# EAGLE design rpihat (EAGLE 7.3.0)
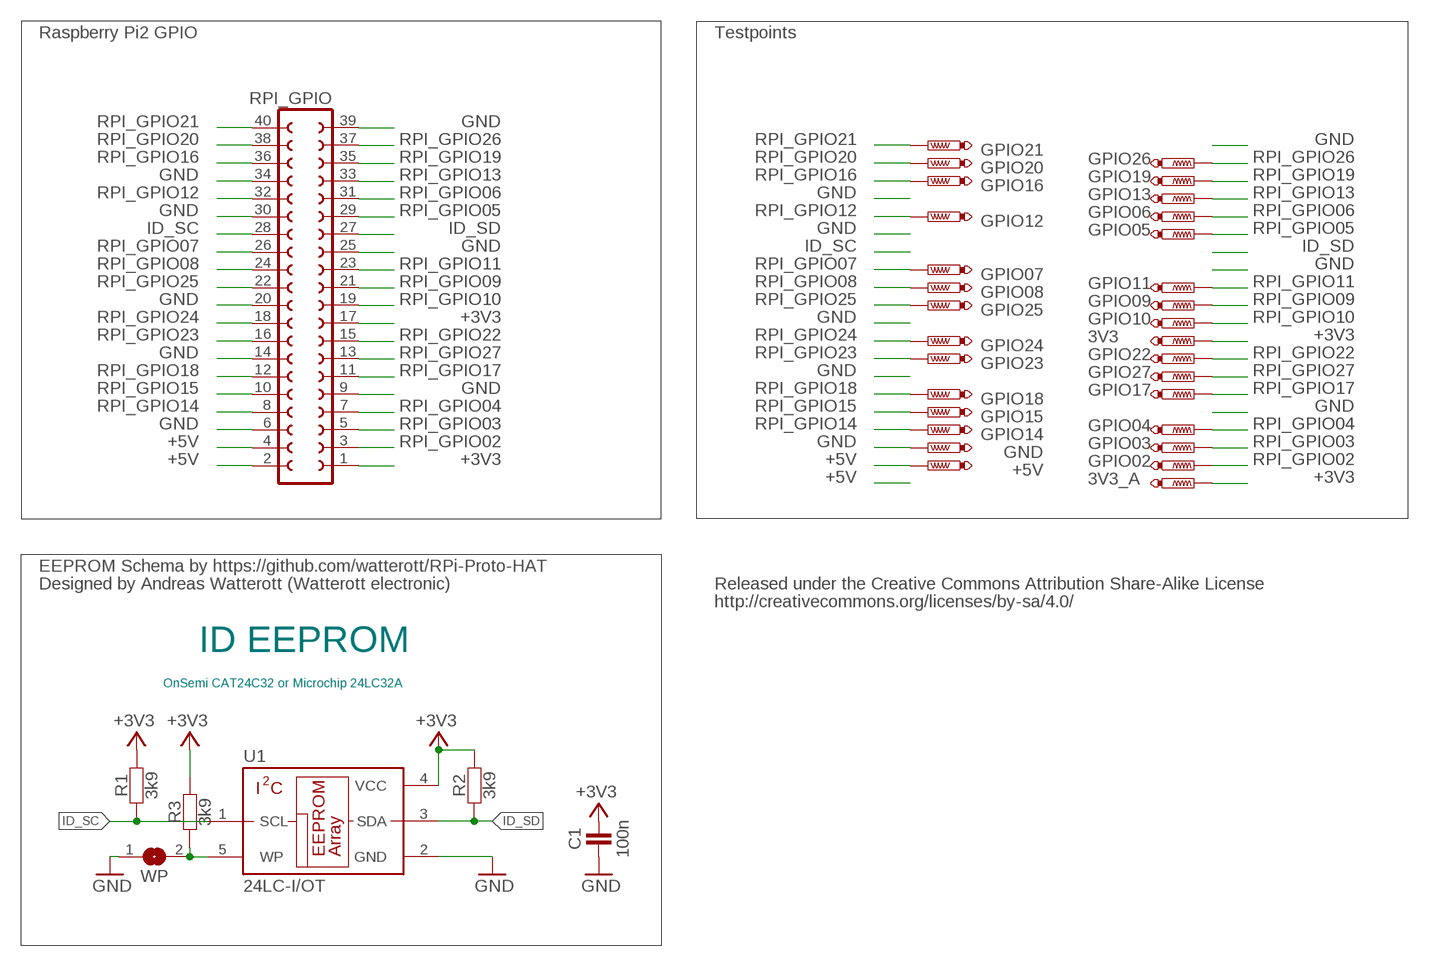
[diagram p0: schematic, sheet 1]

## Parts
3V3  +3.3V  PTR1TP06R  [TP06R]
3V3_A  +3.3V  PTR1TP06R  [TP06R]
+5V  PTR1TP06R  [TP06R]
C1  100n  CAPACITOR-C0603  [R0603]
GND  PTR1TP06R  [TP06R]
GPIO02  PTR1TP06R  [TP06R]
GPIO03  PTR1TP06R  [TP06R]
GPIO04  PTR1TP06R  [TP06R]
GPIO05  PTR1TP06R  [TP06R]
GPIO06  PTR1TP06R  [TP06R]
GPIO07  PTR1TP06R  [TP06R]
GPIO08  PTR1TP06R  [TP06R]
GPIO09  PTR1TP06R  [TP06R]
GPIO10  PTR1TP06R  [TP06R]
GPIO11  PTR1TP06R  [TP06R]
GPIO12  PTR1TP06R  [TP06R]
GPIO13  PTR1TP06R  [TP06R]
GPIO14  PTR1TP06R  [TP06R]
GPIO15  PTR1TP06R  [TP06R]
GPIO16  PTR1TP06R  [TP06R]
GPIO17  PTR1TP06R  [TP06R]
GPIO18  PTR1TP06R  [TP06R]
GPIO19  PTR1TP06R  [TP06R]
GPIO20  PTR1TP06R  [TP06R]
GPIO21  PTR1TP06R  [TP06R]
GPIO22  PTR1TP06R  [TP06R]
GPIO23  PTR1TP06R  [TP06R]
GPIO24  PTR1TP06R  [TP06R]
GPIO25  PTR1TP06R  [TP06R]
GPIO26  PTR1TP06R  [TP06R]
GPIO27  PTR1TP06R  [TP06R]
R1  3k9  RESISTOR-R0603  [R0603]
R2  3k9  RESISTOR-R0603  [R0603]
R3  3k9  RESISTOR-R0603  [R0603]
RPI_GPIO  FE20-2  [FE20-2]
U1  24LC-I/OT  [SOT23-5]
WP  JUMPER2-NOCREAM  [JUMPER2_NC]

## Nets
+3V3: 3V3.TP 3V3_A.TP C1.2 R1.2 R2.2 R3.2 RPI_GPIO.1 RPI_GPIO.17 U1.4(VCC)
+5V: +5V.TP RPI_GPIO.2 RPI_GPIO.4
GND: C1.1 GND.TP RPI_GPIO.6 RPI_GPIO.9 RPI_GPIO.14 RPI_GPIO.20 RPI_GPIO.25 RPI_GPIO.30 RPI_GPIO.34 RPI_GPIO.39 U1.2(GND) WP.1
ID_SC: R1.1 RPI_GPIO.28 U1.1(SCL)
ID_SD: R2.1 RPI_GPIO.27 U1.3(SDA)
RPI_GPIO02: GPIO02.TP RPI_GPIO.3
RPI_GPIO03: GPIO03.TP RPI_GPIO.5
RPI_GPIO04: GPIO04.TP RPI_GPIO.7
RPI_GPIO05: GPIO05.TP RPI_GPIO.29
RPI_GPIO06: GPIO06.TP RPI_GPIO.31
RPI_GPIO07: GPIO07.TP RPI_GPIO.26
RPI_GPIO08: GPIO08.TP RPI_GPIO.24
RPI_GPIO09: GPIO09.TP RPI_GPIO.21
RPI_GPIO10: GPIO10.TP RPI_GPIO.19
RPI_GPIO11: GPIO11.TP RPI_GPIO.23
RPI_GPIO12: GPIO12.TP RPI_GPIO.32
RPI_GPIO13: GPIO13.TP RPI_GPIO.33
RPI_GPIO14: GPIO14.TP RPI_GPIO.8
RPI_GPIO15: GPIO15.TP RPI_GPIO.10
RPI_GPIO16: GPIO16.TP RPI_GPIO.36
RPI_GPIO17: GPIO17.TP RPI_GPIO.11
RPI_GPIO18: GPIO18.TP RPI_GPIO.12
RPI_GPIO19: GPIO19.TP RPI_GPIO.35
RPI_GPIO20: GPIO20.TP RPI_GPIO.38
RPI_GPIO21: GPIO21.TP RPI_GPIO.40
RPI_GPIO22: GPIO22.TP RPI_GPIO.15
RPI_GPIO23: GPIO23.TP RPI_GPIO.16
RPI_GPIO24: GPIO24.TP RPI_GPIO.18
RPI_GPIO25: GPIO25.TP RPI_GPIO.22
RPI_GPIO26: GPIO26.TP RPI_GPIO.37
RPI_GPIO27: GPIO27.TP RPI_GPIO.13
WP: R3.1 U1.5(WP) WP.2

## Notes on the sheet
- Raspberry Pi2 GPIO | Testpoints
- EEPROM Schema by https://github.com/watterott/RPi-Proto-HAT
- Designed by Andreas Watterott (Watterott electronic) | Released under the Creative Commons Attribution Share-Alike License
- http://creativecommons.org/licenses/by-sa/4.0/
- ID EEPROM
- OnSemi CAT24C32 or Microchip 24LC32A

## Library data of the parts
3V3 3V3_A +5V GND GPIO02-GPIO09 GPIO10-GPIO27 = testpad:PTR1: TEST PIN
C1 = we-rcl:CAPACITOR: Capacitors ...2.2uF -> 0603 ...4.7uF -> 0805 ...10uF -> 1206
R1-R3 = we-rcl:RESISTOR
RPI_GPIO = con-lsta:FE20-2: FEMALE HEADER; OC_FARNELL: unknown; OC_NEWARK: unknown
U1 = we-chip:24LC*: Microchip I2C EEPROM 2 Kbit - 24LC02B - 24LC02BT-I/OTDKR-ND 32 Kbit- 24LC32A - 24LC32AT-I/OTDKR-ND; DIGIKEY: 24LC32AT-I/OTDKR-ND
WP = we-rcl:JUMPER2

## Board
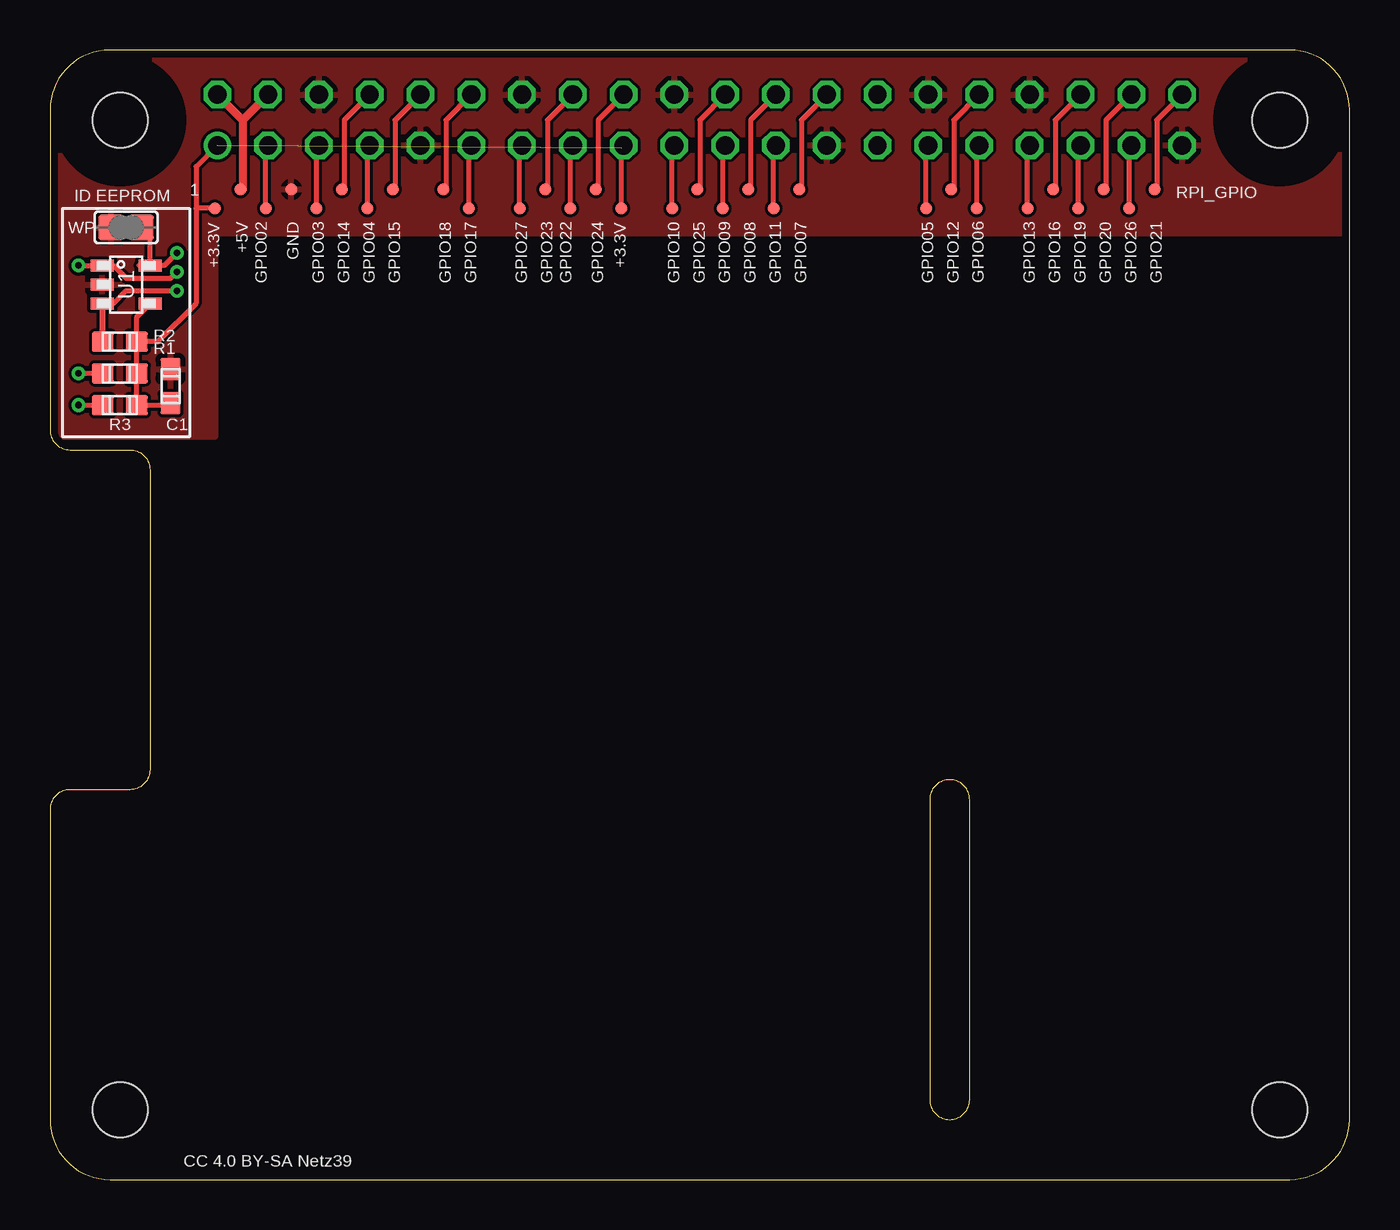
[diagram p1: board, top side]
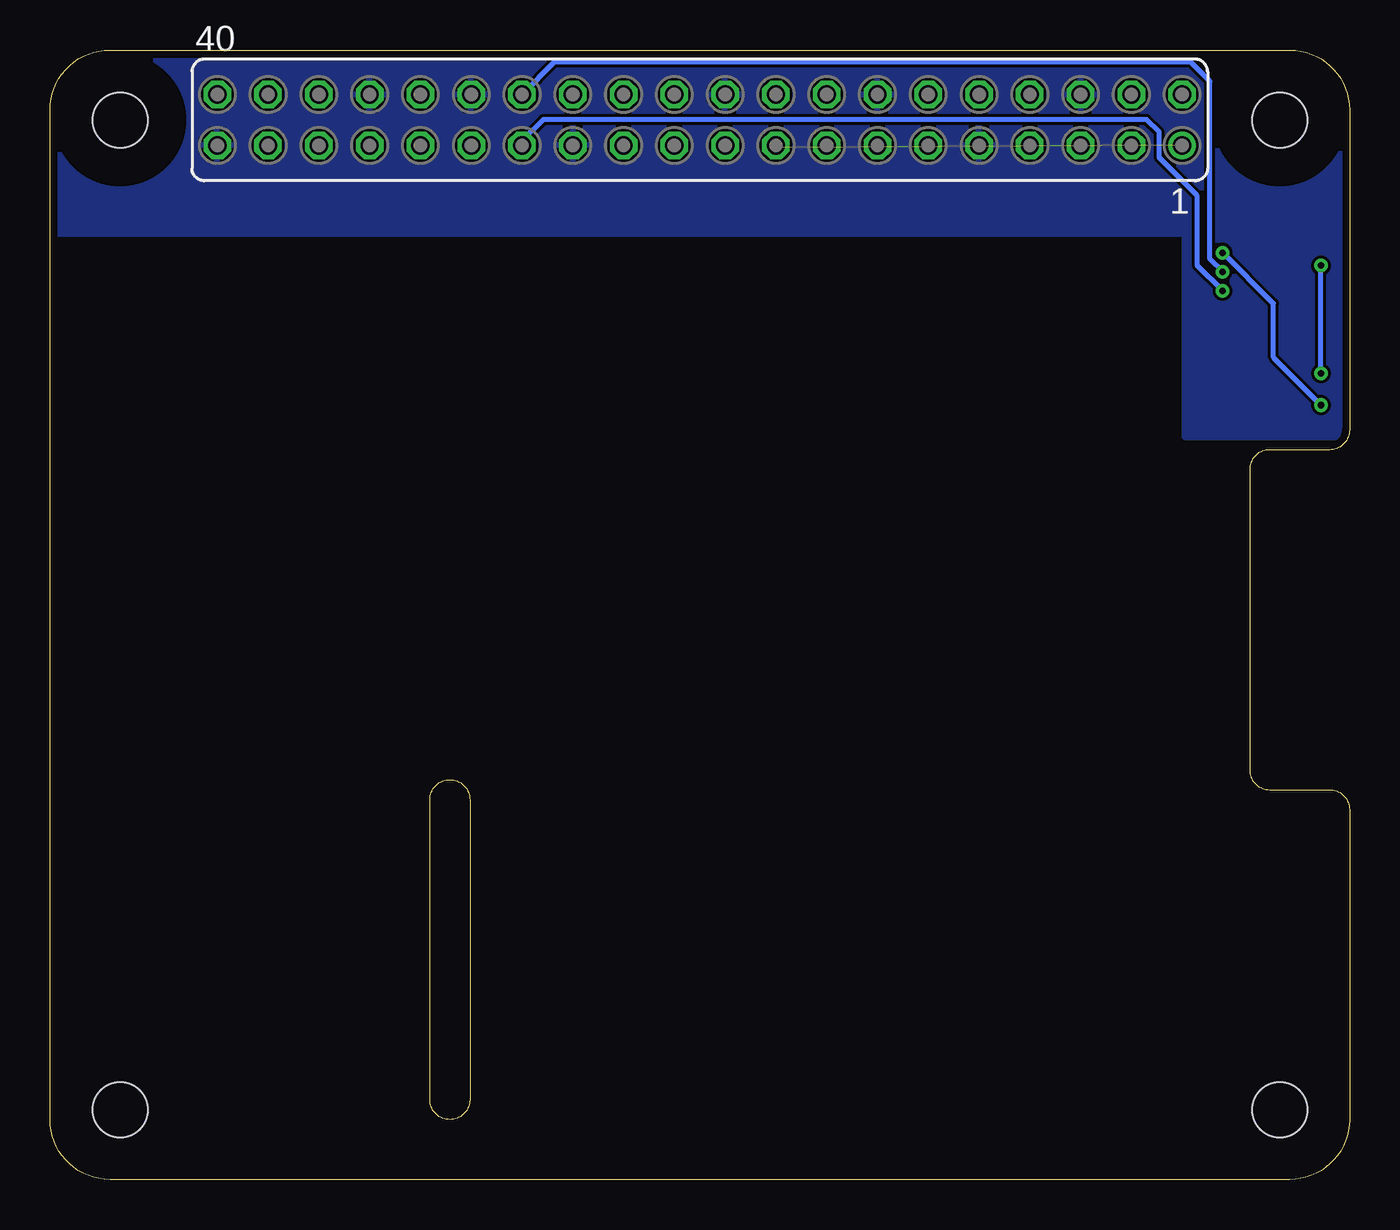
[diagram p2: board, bottom side, seen from below]

Size 65 x 56.5 mm. Coordinates in mm from the lower left corner, seen from the top.
Outline: 0,53.5 0,37.5 arc90 1,36.5 4,36.5 arc-90 5,35.5 5,20.5 arc-90 4,19.5 1,19.5 arc90 0,18.5 0,3 arc90 3,0 62,0 arc90 65,3 65,53.5 arc90 62,56.5 3,56.5 arc90 0,53.5
Outline: 45,20 arc90 44,19 44,4 arc90 45,3 arc90 46,4 46,19 arc90 45,20
Copper layers (1*16): Top 0.0356mm / dielectric 1.5011mm / Bottom 0.0356mm
Design rules "LaenPCBOrder *": minimum track width 6mil, minimum drill 13mil, track to track 6mil, track to pad 6mil, pad to pad 6mil, via to via 6mil, smd to smd 6mil, copper to edge 15mil, drill to drill 6mil, minimum pad ring 7mil, minimum via ring 7mil, stop-mask expansion 3mil, vias tented up to drill 0mil, thermal gap 10mil
Holes 2.75 mm at 3.5,3.5 61.5,3.5 61.5,53 3.5,53
tRestrict: area 0.4,49.9 to 6.7,56.1; area 58.4,49.9 to 64.7,56.1; area 58.4,0.4 to 64.7,6.7; area 0.4,0.4 to 6.7,6.7
bRestrict: area 0.4,49.9 to 6.7,56.1; area 0.4,0.4 to 6.7,6.7; area 58.4,49.9 to 64.7,56.1; area 58.4,0.4 to 64.7,6.7

### Footprints (pad centres in the part's own frame; a part is rotated, then mirrored left to right if it is on the bottom)
TP06R = smd 0.6 x 0.6: TP 0,0
R0603 = smd 1 x 1.1: 1 0,0.85; 2 0,-0.85
FE20-2 = drill 0.914: 1 -24.13,1.27 | drill 0.914 octagon: 2 -24.13,-1.27; 3 -21.59,1.27; 4 -21.59,-1.27; 5 -19.05,1.27; 6 -19.05,-1.27; 7 -16.51,1.27; 8 -16.51,-1.27; 9 -13.97,1.27; 10 -13.97,-1.27; 11 -11.43,1.27; 12 -11.43,-1.27; 13 -8.89,1.27; 14 -8.89,-1.27; 15 -6.35,1.27; 16 -6.35,-1.27; 17 -3.81,1.27; 18 -3.81,-1.27; 19 -1.27,1.27; 20 -1.27,-1.27; 21 1.27,1.27; 22 1.27,-1.27; 23 3.81,1.27; 24 3.81,-1.27; 25 6.35,1.27; 26 6.35,-1.27; 27 8.89,1.27; 28 8.89,-1.27; 29 11.43,1.27; 30 11.43,-1.27; 31 13.97,1.27; 32 13.97,-1.27; 33 16.51,1.27; 34 16.51,-1.27; 35 19.05,1.27; 36 19.05,-1.27; 37 21.59,1.27; 38 21.59,-1.27; 39 24.13,1.27; 40 24.13,-1.27
SOT23-5 = smd 1.2 x 0.6: 1 -1.2,0.95; 2 -1.2,0; 3 -1.2,-0.95; 4 1.2,-0.95; 5 1.2,0.95
JUMPER2_NC = smd 1.25 x 1.25: 1 0,0.76; 2 0,-0.76

### Placement (x,y rotation side)
3V3  8.26,48.58 0 top
3V3_A  28.57,48.58 0 top
+5V  9.53,49.53 0 top
C1  6.03,39.69 0 top
GND  12.06,49.53 270 top
GPIO02  10.79,48.58 0 top
GPIO03  13.34,48.58 0 top
GPIO04  15.88,48.58 0 top
GPIO05  43.81,48.58 0 top
GPIO06  46.35,48.58 270 top
GPIO07  37.47,49.53 0 top
GPIO08  34.92,49.53 0 top
GPIO09  33.66,48.58 0 top
GPIO10  31.11,48.58 0 top
GPIO11  36.2,48.58 0 top
GPIO12  45.09,49.53 0 top
GPIO13  48.9,48.58 0 top
GPIO14  14.61,49.53 0 top
GPIO15  17.14,49.53 0 top
GPIO16  50.16,49.53 0 top
GPIO17  20.95,48.58 0 top
GPIO18  19.68,49.53 0 top
GPIO19  51.44,48.58 0 top
GPIO20  52.7,49.53 0 top
GPIO21  55.24,49.53 0 top
GPIO22  26.04,48.58 0 top
GPIO23  24.77,49.53 0 top
GPIO24  27.3,49.53 0 top
GPIO25  32.38,49.53 0 top
GPIO26  53.98,48.58 0 top
GPIO27  23.5,48.58 0 top
R1  3.49,40.32 90 top
R2  3.49,41.91 90 top
R3  3.49,38.73 90 top
RPI_GPIO  32.5,53 180 bottom
U1  3.81,44.77 0 top
WP  3.81,47.62 90 top

### Tracks (layer width: path | path; a pad name or v marks a point on that pad's centre or on a via)
+3V3  (1 unrouted)
  Top 0.254: 6.03,38.73 R3.2 R1.2 R2.2 | R2.2 4.34,43.15 U1.4 | RPI_GPIO.1 7.3,50.66 7.3,48.58 | 7.3,48.58 7.3,43.81 5.4,41.91 R2.2 | 3V3.TP 7.3,48.58 | 3V3_A.TP 28.57,51.62 RPI_GPIO.17
  Top 0.305: 6.03,38.73 C1.2
+5V
  Top 0.254: 9.64,49.53 9.53,49.41 +5V.TP
  Top 0.406: RPI_GPIO.4 9.64,53 | 9.64,53 9.64,49.53 | RPI_GPIO.2 9.64,53
GND
  pour Top (isolate 0.152): 8.26,37.15 0,37.15 0,56.52 65.09,56.52 65.09,47.31 8.26,47.31
  pour Bottom (isolate 0.152): 8.26,37.15 0,37.15 0,56.52 65.09,56.52 65.09,47.31 8.26,47.31
ID_SC  (via drill 0.33)
  Top 0.254: U1.1 3.18,45.72 3.81,45.09 6.03,45.09 v6.35,45.4 | R1.1 v1.43,40.32 | v1.43,45.72 U1.1
  Top 0.305: U1.1
  Bottom 0.254: v1.43,40.32 v1.43,45.72 | v6.35,45.4 6.99,46.04 6.99,54.93 7.94,55.88 39.78,55.88 RPI_GPIO.28
ID_SD  (via drill 0.33)
  Top 0.254: U1.3 3.18,43.82 3.81,44.45 v6.35,44.45
  Top 0.305: U1.3 2.61,42.26 R2.1
  Bottom 0.254: v6.35,44.45 7.62,45.72 7.62,49.21 9.53,51.12 9.53,52.39 10.16,53.02 40.32,53.02 41.39,51.95 RPI_GPIO.27
RPI_GPIO02
  Top 0.254: GPIO02.TP 10.79,51.62 RPI_GPIO.3
RPI_GPIO03
  Top 0.254: GPIO03.TP 13.34,51.62 RPI_GPIO.5
RPI_GPIO04
  Top 0.254: GPIO04.TP 15.88,51.62 RPI_GPIO.7
RPI_GPIO05
  Top 0.254: GPIO05.TP 43.81,51.62 RPI_GPIO.29
RPI_GPIO06
  Top 0.254: GPIO06.TP 46.35,51.62 RPI_GPIO.31
RPI_GPIO07
  Top 0.254: RPI_GPIO.26 37.58,53 37.58,49.53 37.47,49.41 GPIO07.TP
RPI_GPIO08
  Top 0.254: RPI_GPIO.24 35.04,53 35.04,49.53 34.92,49.41 GPIO08.TP
RPI_GPIO09
  Top 0.254: GPIO09.TP 33.66,51.62 RPI_GPIO.21
RPI_GPIO10
  Top 0.254: GPIO10.TP 31.11,51.62 RPI_GPIO.19
RPI_GPIO11
  Top 0.254: GPIO11.TP 36.2,51.62 RPI_GPIO.23
RPI_GPIO12
  Top 0.254: RPI_GPIO.32 45.2,53 45.2,49.53 45.09,49.41 GPIO12.TP
RPI_GPIO13
  Top 0.254: GPIO13.TP 48.9,51.62 RPI_GPIO.33
RPI_GPIO14
  Top 0.254: RPI_GPIO.8 14.72,53 14.72,49.53 14.61,49.41 GPIO14.TP
RPI_GPIO15
  Top 0.254: RPI_GPIO.10 17.26,53 17.26,49.53 17.14,49.41 GPIO15.TP
RPI_GPIO16
  Top 0.254: RPI_GPIO.36 50.28,53 50.28,49.53 50.16,49.41 GPIO16.TP
RPI_GPIO17
  Top 0.254: GPIO17.TP 20.95,51.62 RPI_GPIO.11
RPI_GPIO18
  Top 0.254: RPI_GPIO.12 19.8,53 19.8,49.53 19.68,49.41 GPIO18.TP
RPI_GPIO19
  Top 0.254: GPIO19.TP 51.44,51.62 RPI_GPIO.35
RPI_GPIO20
  Top 0.254: RPI_GPIO.38 52.82,53 52.82,49.53 52.7,49.41 GPIO20.TP
RPI_GPIO21
  Top 0.254: RPI_GPIO.40 55.36,53 55.36,49.53 55.24,49.41 GPIO21.TP
RPI_GPIO22
  Top 0.254: GPIO22.TP 26.04,51.62 RPI_GPIO.15
RPI_GPIO23
  Top 0.254: RPI_GPIO.16 24.88,53 24.88,49.53 24.77,49.41 GPIO23.TP
RPI_GPIO24
  Top 0.254: RPI_GPIO.18 27.42,53 27.42,49.53 27.3,49.41 GPIO24.TP
RPI_GPIO25
  Top 0.254: RPI_GPIO.22 32.5,53 32.5,49.53 32.38,49.41 GPIO25.TP
RPI_GPIO26
  Top 0.254: GPIO26.TP 53.98,51.62 RPI_GPIO.37
RPI_GPIO27
  Top 0.254: GPIO27.TP 23.5,51.62 RPI_GPIO.13
WP  (via drill 0.33)
  Top 0.254: U1.5 5.01,47.5 | v1.43,38.73 R3.1 | 4.45,45.72 U1.5 | v6.35,46.35 5.71,45.72 U1.5
  Top 0.305: 5.01,47.5 WP.2 | U1.5 4.76,45.72
  Bottom 0.254: v1.43,38.73 3.81,41.12 3.81,43.81 v6.35,46.35

### Text on the board
tNames: ID EEPROM | 1 | CC 4.0 BY-SA Netz39
Document: When drawing more than | 500mA from the 5V pins, | re-wire accordingly! | Cutout is optinonal | and may be removed. | Cutout is optinonal | and may be removed.